# Altium schematic sheet SCH_WSTICKSR.schdoc
size 227 x 151 mm
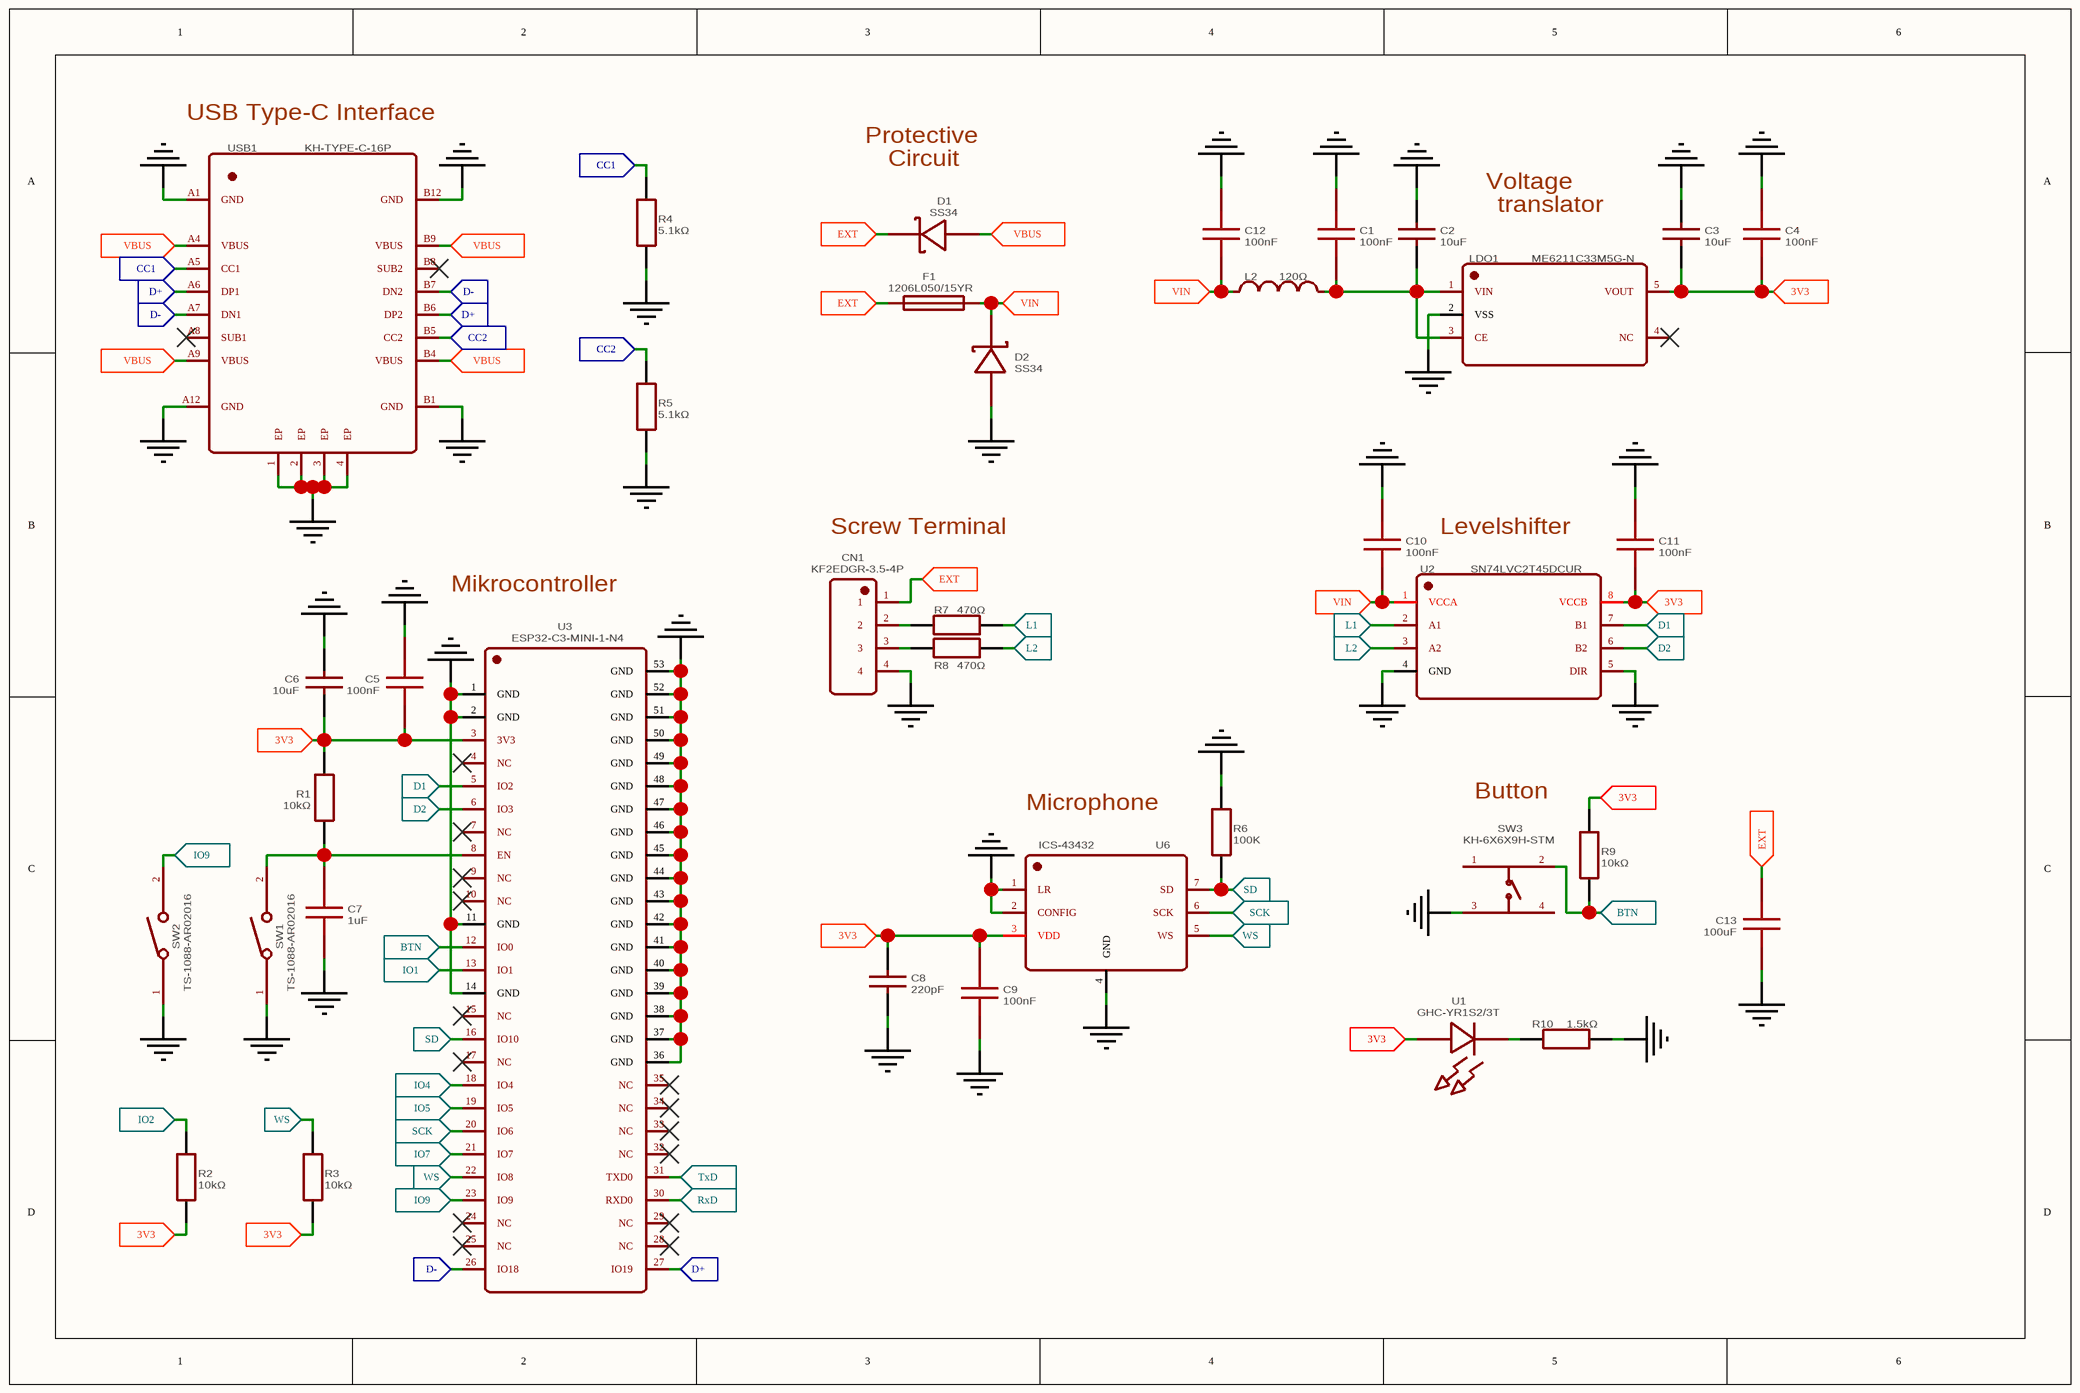
[diagram p0: SCH_WSTICKSR.schdoc]

## Parts
C1  100nF  [C0402]
C2  10uF  [C0402]
C3  10uF  [C0402]
C4  100nF  [C0402]
C5  100nF  [C0402]
C6  10uF  [C0402]
C7  1uF  [C0402]
C8  220pF  [C0402]
C9  100nF  [C0402]
C10  100nF  [C0402]
C11  100nF  [C0402]
C12  100nF  [C0402]
C13  100uF  [C1210]
CN1  KF2EDGR-3.5-4P  [CONN-TH_4P-P3.50_KF2EDGR-3.5-4P]
D1  SS34  [SMB_L4.6-W3.6-LS5.3-R-RD]
D2  SS34  [SMB_L4.6-W3.6-LS5.3-R-RD]
F1  1206L050/15YR  [F1206]
L2  120Ω  [L0603]
LDO1  ME6211C33M5G-N  [SOT-23-5_L3.0-W1.7-P0.95-LS2.8-BR]
R1  10kΩ  [R0402]
R2  10kΩ  [R0402]
R3  10kΩ  [R0402]
R4  5.1kΩ  [R0402]
R5  5.1kΩ  [R0402]
R6  100K  [R0402]
R7  470Ω  [R0402]
R8  470Ω  [R0402]
R9  10kΩ  [R0402]
R10  1.5kΩ  [R0402]
SW1  TS-1088-AR02016  [SW-SMD_L4.0-W2.9-LS5.0]
SW2  TS-1088-AR02016  [SW-SMD_L4.0-W2.9-LS5.0]
SW3  KH-6X6X9H-STM  [SW-SMD_4P-L6.0-W6.0-P4.50-LS9.0-2]
U1  GHC-YR1S2/3T  [LED0603-R-RD_GREEN]
U2  SN74LVC2T45DCUR  [VSSOP-8_L2.4-W2.1-P0.50-LS3.2-BR]
U3  ESP32-C3-MINI-1-N4  [WIFIM-SMD_ESP32-C3-MINI-1]
U6  ICS-43432  [SENSOR-SMD_ICS-43432]
USB1  KH-TYPE-C-16P  [USB-C-SMD_KH-TYPE-C-16P]

## Ports
3V3 (in), BTN (in), CC1 (in), CC2 (in), D1 (in), D2 (in), D+ (in), D- (in), EXT (in), IO1 (in), IO2 (in), IO4 (in), IO5 (in), IO7 (in), IO9 (in), L1 (in), L2 (in), RxD (in), SCK (in), SD (in), TxD (in), VBUS (in), VIN (in), WS (in)

## Nets
GND: C1.1 C2.1 C3.1 C4.1 C5.1 C6.1 C7.2 C8.2 C9.2 C10.1 C11.1 C12.1 C13.1 CN1.4 D2.1(A) LDO1.2(VSS) R4.2 R5.2 R6.1 R10.2 SW1.1 SW2.1 SW3.3(C) U2.4(GND) U2.5(DIR) U3.1(GND) U3.2(GND) U3.11(GND) U3.14(GND) U3.36(GND) U3.37(GND) U3.38(GND) U3.39(GND) U3.40(GND) U3.41(GND) U3.42(GND) U3.43(GND) U3.44(GND) U3.45(GND) U3.46(GND) U3.47(GND) U3.48(GND) U3.49(GND) U3.50(GND) U3.51(GND) U3.52(GND) U3.53(GND) U6.1(LR) U6.2(CONFIG) U6.4(GND) USB1.1(EP) USB1.2(EP) USB1.3(EP) USB1.4(EP) USB1.A1(GND) USB1.A12(GND) USB1.B1(GND) USB1.B12(GND)
3V3: C3.2 C4.2 C5.2 C6.2 C8.1 C9.1 C11.2 LDO1.5(VOUT) R1.1 R2.2 R3.2 R9.1 U1.1(+) U2.8(VCCB) U3.3(3V3) U6.3(VDD) ; port 3V3
BTN: R9.2 SW3.2(B) U3.12(IO0) ; port BTN
CC1: R4.1 USB1.A5(CC1) ; port CC1
CC2: R5.1 USB1.B5(CC2) ; port CC2
D1: U2.7(B1) U3.5(IO2) ; port D1
D2: U2.6(B2) U3.6(IO3) ; port D2
D+: U3.27(IO19) USB1.A6(DP1) USB1.B6(DP2) ; port D+
D-: U3.26(IO18) USB1.A7(DN1) USB1.B7(DN2) ; port D-
EXT: C13.2 CN1.1 D1.2(K) F1.1 ; port EXT
IO1: U3.13(IO1) ; port IO1
IO2: R2.1 ; port IO2
IO4: U3.18(IO4) ; port IO4
IO5: U3.19(IO5) ; port IO5
IO7: U3.21(IO7) ; port IO7
IO9: SW2.2 U3.23(IO9) ; port IO9
L1: R7.2 U2.2(A1) ; port L1
L2: R8.2 U2.3(A2) ; port L2
RxD: U3.30(RXD0) ; port RxD
SCK: U3.20(IO6) U6.6(SCK) ; port SCK
SD: R6.2 U3.16(IO10) U6.7(SD) ; port SD
TxD: U3.31(TXD0) ; port TxD
VBUS: D1.1(A) USB1.A4(VBUS) USB1.A9(VBUS) USB1.B4(VBUS) USB1.B9(VBUS) ; port VBUS
VIN: C10.2 C12.2 D2.2(K) F1.2 L2.1 U2.1(VCCA) ; port VIN
WS: R3.1 U3.22(IO8) U6.5(WS) ; port WS
NetC1_2: C1.2 C2.2 L2.2 LDO1.1(VIN) LDO1.3(CE)
NetC7_1: C7.1 R1.2 SW1.2 U3.8(EN)
NetCN1_2: CN1.2 R7.1
NetCN1_3: CN1.3 R8.1
NetR10_1: R10.1 U1.2(-)

Not connected (* = marked no-connect by the designer): LDO1 4(NC)*; SW3 1(A) 4(D); U3 4(NC)* 7(NC)* 9(NC)* 10(NC)* 15(NC)* 17(NC)* 24(NC)* 25(NC)* 28(NC)* 29(NC)* 32(NC)* 33(NC)* 34(NC)* 35(NC)*; USB1 A8(SUB1)* B8(SUB2)*

## Notes on the sheet
- (near USB1) USB Type-C Interface
- (near D1) Protective
- (near D1) Circuit
- Voltage
- translator
- Mikrocontroller
- Screw Terminal
- Levelshifter
- Microphone
- Button

## Library data of the parts
C1 C4 C5 C9-C12 = 100nF: BOM_Manufacturer: Samsung Electro-Mechanics; BOM_Manufacturer Part: CL05B104KB54PNC; nameAlias: Capacitance; Contributor: LCSC; BOM_Supplier: LCSC; BOM_Supplier Part: C307331; BOM_JLCPCB Part Class: Basic Part; spicePre: C; spiceSymbolName: CL05B104KB54PNC
C2 C3 C6 = 10uF: BOM_Manufacturer Part: CL05A106MQ5NUNC; BOM_Manufacturer: SAMSUNG(三星); nameAlias: Capacitance; BOM_Supplier: LCSC; BOM_Supplier Part: C15525; BOM_JLCPCB Part Class: Basic Part; spicePre: C; spiceSymbolName: CL05A106MQ5NUNC
C7 = 1uF: BOM_Manufacturer: SAMSUNG; BOM_Manufacturer Part: CL05A105KA5NQNC; nameAlias: Capacitance; BOM_Supplier: LCSC; BOM_Supplier Part: C52923; BOM_JLCPCB Part Class: Basic Part; spicePre: C; spiceSymbolName: CL05A105KA5NQNC
C8 = 220pF: BOM_Manufacturer: FH; BOM_Manufacturer Part: 0402B221K500NT; nameAlias: Capacitance; BOM_Supplier: LCSC; BOM_Supplier Part: C1530; BOM_JLCPCB Part Class: Basic Part; spicePre: C; spiceSymbolName: 0402B221K500NT
C13 = 100uF: BOM_Manufacturer: TAIYO YUDEN(太诱); BOM_Manufacturer Part: EMK325ABJ107MM-T; nameAlias: Capacitance; Contributor: LCSC; BOM_Supplier: LCSC; BOM_Supplier Part: C394395; BOM_JLCPCB Part Class: Extended Part; spicePre: C; spiceSymbolName: EMK325ABJ107MM-T
CN1 = KF2EDGR-3.5-4P: BOM_Manufacturer: Cixi Kefa Elec; Contributor: LCSC; BOM_Supplier: LCSC; BOM_Supplier Part: C441173; BOM_Manufacturer Part: KF2EDGR-3.5-4P; BOM_JLCPCB Part Class: Extended Part; spicePre: C; spiceSymbolName: KF2EDGR-3.5-4P
D1 D2 = SS34: BOM_Manufacturer: MDD; BOM_Supplier: LCSC; BOM_Manufacturer Part: SS34; BOM_Supplier Part: C13762; BOM_JLCPCB Part Class: Extended Part; spicePre: D; spiceSymbolName: SS34_C13762
F1 = 1206L050/15YR: BOM_Manufacturer: Littelfuse(美国力特); Contributor: LCSC; BOM_Supplier: LCSC; BOM_Supplier Part: C151162; BOM_Manufacturer Part: 1206L050/15YR; BOM_JLCPCB Part Class: Extended Part; spicePre: F; spiceSymbolName: 1206L050/15YR
L2 = 120Ω: BOM_Manufacturer: Sunlord; BOM_Manufacturer Part: PZ1608D121-2R0TF; nameAlias: Value; BOM_Supplier: LCSC; BOM_Supplier Part: C42102; BOM_JLCPCB Part Class: Extended Part; spicePre: L; spiceSymbolName: PZ1608D121-2R0TF
LDO1 = ME6211C33M5G-N: BOM_Manufacturer: MICRONE; BOM_Supplier: LCSC; BOM_Manufacturer Part: ME6211C33M5G-N; BOM_Supplier Part: C82942; BOM_JLCPCB Part Class: Extended Part; spicePre: L; spiceSymbolName: ME6211C33M5G-N
R1-R3 R9 = 10kΩ: BOM_Manufacturer: UniOhm; BOM_Manufacturer Part: 0402WGF1002TCE; nameAlias: Resistance; Resistance (Ohms): 10K; BOM_Supplier: LCSC; BOM_Supplier Part: C25744; BOM_JLCPCB Part Class: Basic Part; spicePre: R; spiceSymbolName: 0402WGF1002TCE
R4 R5 = 5.1kΩ: BOM_Manufacturer: UniOhm; BOM_Manufacturer Part: 0402WGF5101TCE; nameAlias: Resistance; Resistance (Ohms): 5.1K; BOM_Supplier: LCSC; BOM_Supplier Part: C25905; BOM_JLCPCB Part Class: Basic Part; spicePre: R; spiceSymbolName: 0402WGF5101TCE
R6 = 100K: BOM_Manufacturer: UniOhm; BOM_Manufacturer Part: 0402WGF1003TCE; nameAlias: Resistance (Ohms); BOM_Supplier: LCSC; BOM_Supplier Part: C25741; BOM_JLCPCB Part Class: Basic Part; spicePre: R; spiceSymbolName: 0402WGF1003TCE
R7 R8 = 470Ω: BOM_Manufacturer: UniOhm; BOM_Manufacturer Part: 0402WGF4700TCE; nameAlias: Resistance; Resistance (Ohms): 470; BOM_Supplier: LCSC; BOM_Supplier Part: C25117; BOM_JLCPCB Part Class: Basic Part; spicePre: R; spiceSymbolName: 0402WGF4700TCE
R10 = 1.5kΩ: BOM_Manufacturer: UNI-ROYAL(厚声); BOM_Manufacturer Part: 0402WGF1501TCE; nameAlias: Resistance; Resistance (Ohms): 1.5K; BOM_Supplier: LCSC; BOM_Supplier Part: C25867; BOM_JLCPCB Part Class: Basic Part; spicePre: R; spiceSymbolName: 0402WGF1501TCE
SW1 SW2 = TS-1088-AR02016: BOM_Manufacturer: XUNPU; Contributor: LCSC; BOM_Supplier: LCSC; BOM_Supplier Part: C720477; BOM_Manufacturer Part: TS-1088-AR02016; BOM_JLCPCB Part Class: Extended Part; spicePre: S; spiceSymbolName: TS-1088-AR02016
SW3 = KH-6X6X9H-STM: BOM_Manufacturer: kinghelm(金航标); Contributor: LCSC; BOM_Supplier: LCSC; BOM_Supplier Part: C2837535; BOM_Manufacturer Part: KH-6X6X9H-STM; BOM_JLCPCB Part Class: Extended Part; spicePre: S; spiceSymbolName: KH-6X6X9H-STM
U1 = GHC-YR1S2/3T: BOM_Manufacturer: EVERLIGHT(亿光); BOM_Manufacturer Part: 19-21/GHC-YR1S2/3T; Contributor: LCSC; BOM_Supplier: LCSC; BOM_Supplier Part: C2973113; link: https://atta.szlcsc.com//upload/public/pdf/source/20220210/56BBA1423D7EFF23FCE0A3772A3A380D.pdf; BOM_JLCPCB Part Class: Extended Part; spicePre: U; spiceSymbolName: 19-21/GHC-YR1S2/3T
U2 = SN74LVC2T45DCUR: BOM_Manufacturer: TI(德州仪器); BOM_Supplier: LCSC; BOM_Manufacturer Part: SN74LVC2T45DCUR; BOM_Supplier Part: C15741; BOM_JLCPCB Part Class: Extended Part; spicePre: U; spiceSymbolName: SN74LVC2T45DCUR
U3 = ESP32-C3-MINI-1-N4: BOM_Manufacturer: ESPRESSIF 乐鑫; Contributor: LCSC; BOM_Supplier: LCSC; BOM_Supplier Part: C2838502; BOM_Manufacturer Part: ESP32-C3-MINI-1-N4; BOM_JLCPCB Part Class: Extended Part; spicePre: U; spiceSymbolName: ESP32-C3-MINI-1-N4
U6 = ICS-43432: BOM_Manufacturer: TDK; Contributor: LCSC; BOM_Supplier: LCSC; BOM_Supplier Part: C574021; BOM_Manufacturer Part: ICS-43432; BOM_JLCPCB Part Class: Extended Part; spicePre: U; spiceSymbolName: ICS-43432
USB1 = KH-TYPE-C-16P: BOM_Manufacturer: kinghelm(金航标); Contributor: LCSC; BOM_Supplier: LCSC; BOM_Supplier Part: C709357; BOM_Manufacturer Part: KH-TYPE-C-16P; BOM_JLCPCB Part Class: Extended Part; spicePre: U; spiceSymbolName: KH-TYPE-C-16P